# EAGLE design power_supply(iteration2) (EAGLE 9.6.2)
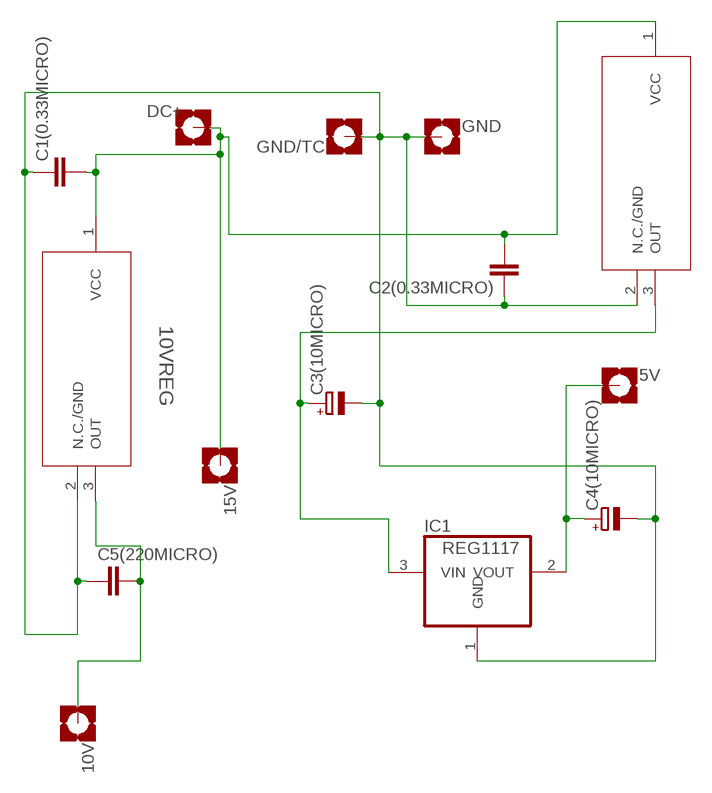
[diagram p0: schematic, sheet 1]

## Parts
5V  MOUNT-PAD-SQUARE2.8  [2,8-PAD-SQUARE]
10V  MOUNT-PAD-SQUARE2.8  [2,8-PAD-SQUARE]
10VREG  BAJ0BC0T  [TO220FP-3_ROM]
10VREG1  BAJ0BC0T  [TO220FP-3_ROM]
15V  MOUNT-PAD-SQUARE2.8  [2,8-PAD-SQUARE]
C1(0.33MICRO)  C-EU025-025X050  [C025-025X050]
C2(0.33MICRO)  C-EU025-025X050  [C025-025X050]
C3(10MICRO)  CPOL-EUE2.5-6  [E2,5-6]
C4(10MICRO)  CPOL-EUE2.5-6  [E2,5-6]
C5(220MICRO)  C-EUC1812K  [C1812K]
DC+  MOUNT-PAD-SQUARE2.8  [2,8-PAD-SQUARE]
GND  MOUNT-PAD-SQUARE2.8  [2,8-PAD-SQUARE]
GND/TC  MOUNT-PAD-SQUARE2.8  [2,8-PAD-SQUARE]
IC1  REG1117  [SOT223_HEATSINK]

## Nets
N$1: 10VREG1.1(VCC) 10VREG.1(VCC) 15V.B2,8(MOUNT) C1(0.33MICRO).2 C2(0.33MICRO).2 DC+.B2,8(MOUNT)
N$2: 10VREG1.2(N.C./GND) 10VREG.2(N.C./GND) C1(0.33MICRO).1 C2(0.33MICRO).1 C3(10MICRO).- C4(10MICRO).- C5(220MICRO).1 GND.B2,8(MOUNT) GND/TC.B2,8(MOUNT) IC1.1(GND)
N$3: 10V.B2,8(MOUNT) 10VREG.3(OUT) C5(220MICRO).2
N$5: 10VREG1.3(OUT) C3(10MICRO).+ IC1.3(VIN)
N$10: 5V.B2,8(MOUNT) C4(10MICRO).+ IC1.2(VOUT)

## Library data of the parts
5V 10V 15V DC+ GND GND/TC = holes:MOUNT-PAD-SQUARE: MOUNTING PAD, square
10VREG 10VREG1 = scipt_lib:BAJ0BC0T; BUILT_BY: EMA_Molly; COPYRIGHT: Copyright (C) 2018 Accelerated Designs. All rights reserved; MANUFACTURER_PART_NUMBER: BAJ0BC0T; SOURCELIBRARY: ROHM_2019-10-21; VENDOR: ROHM Semiconductor
C1(0.33MICRO) C2(0.33MICRO) C5(220MICRO) = rcl:C-EU: CAPACITOR, European symbol; SPICEPREFIX: C
C3(10MICRO) C4(10MICRO) = rcl:CPOL-EU: POLARIZED CAPACITOR, European symbol; SPICEPREFIX: C
IC1 = burr-brown-3:REG1117: 800mA and 1A Low Dropout (LDO) Positive Regulator 1.8V, 2.5V, 2.85V, 3.3V, 5V, and Adj

## Board
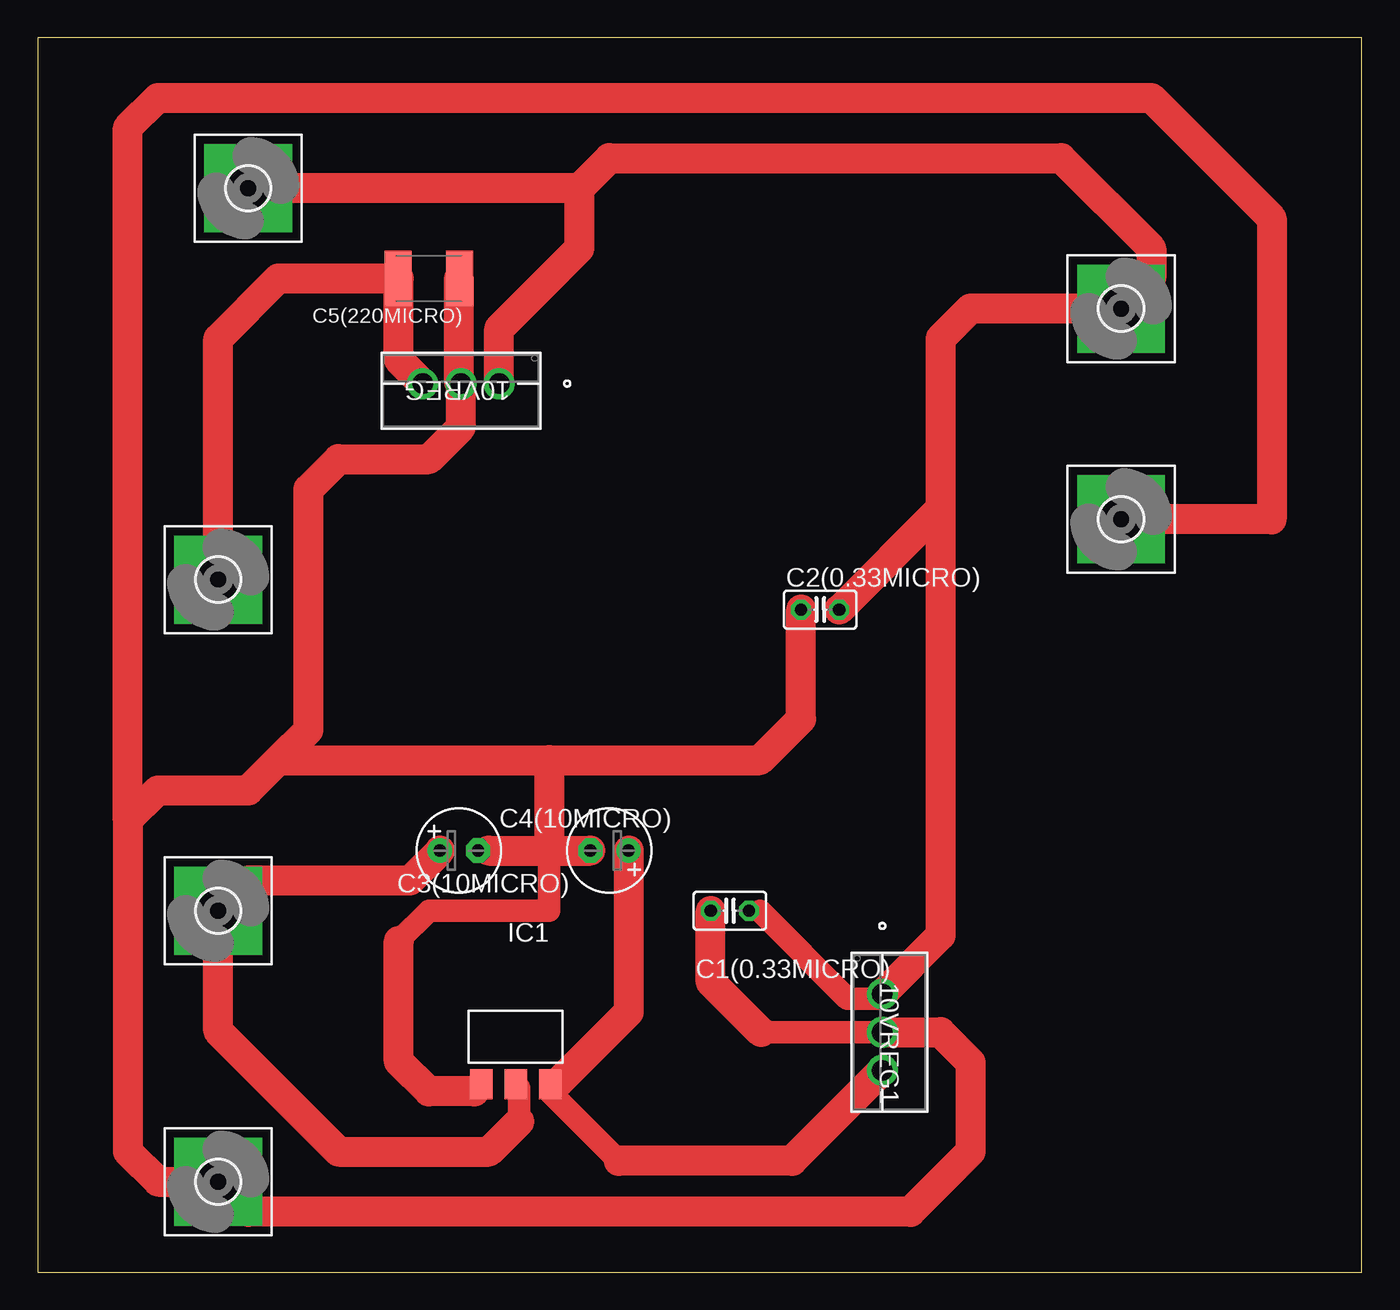
[diagram p1: board, top side]

Size 88 x 82 mm. Coordinates in mm from the lower left corner, seen from the top.
Outline: 0,0 88,0 88,82 0,82 0,0
Copper layers (1*16): Top 0.035mm / dielectric 1.5mm / Bottom 0.035mm
Design rules "default": minimum track width 6mil, minimum drill 0.35mm, track to track 6mil, track to pad 6mil, pad to pad 6mil, via to via 6mil, smd to smd 6mil, copper to edge 40mil, drill to drill 6mil, minimum pad ring 10mil, minimum via ring 8mil, stop-mask expansion 4mil, vias tented up to drill 0mil, thermal gap 10mil

### Footprints (pad centres in the part's own frame; a part is rotated, then mirrored left to right if it is on the bottom)
2,8-PAD-SQUARE = drill 2.8 pad 5.842 square: B2,8 0,0
TO220FP-3_ROM = drill 1.372 pad 1.88: 1 0,0; 2 2.54,0; 3 5.08,0
C025-025X050 = drill 0.813 octagon: 1 -1.27,0; 2 1.27,0
E2,5-6 = drill 0.813 pad 1.6: + -1.27,0 | drill 0.813 pad 1.6 octagon: - 1.27,0
C1812K = smd 1.8 x 3.7: 1 -2.05,0; 2 2.05,0
SOT223_HEATSINK = smd 1.499 x 2.007: 1 -2.261,-3.15; 2 0.025,-3.15; 3 2.311,-3.15

### Placement (x,y rotation side)
5V  12,24 0 top
10V  12,46 0 top
10VREG  30.67,59.02 180 top
10VREG1  56.13,18.47 270 top
15V  14,72 0 top
C1(0.33MICRO)  46,24 0 top
C2(0.33MICRO)  52,44 0 top
C3(10MICRO)  38,28 180 top
C4(10MICRO)  28,28 0 top
C5(220MICRO)  26,66 180 top
DC+  72,64 0 top
GND  12,6 0 top
GND/TC  72,50 0 top
IC1  31.75,15.62 0 top

### Tracks (layer width: path | path; a pad name or v marks a point on that pad's centre or on a via)
N$1
  Top 0.152: 10VREG1.1 55.83,18.17 55.66,18 | C1(0.33MICRO).2 48,24
  Top 1.5: 55.83,18.17 53.83,18.17 48,24
  Top 2: 36,72 15V.B2,8 | 10VREG.1 30.67,62.67 36,68 36,72 | 10VREG1.1 60,22.34 60,50.73 | 60,50.73 60,62 62,64 DC+.B2,8 74,66 74,68 68,74 38,74 36,72 | C2(0.33MICRO).2 60,50.73
N$2
  Top 0.152: 28.64,11.62 IC1.1 29.02,12 | 28,59.15 10VREG.2 28.13,58.13 | 28,65.95 C5(220MICRO).1 | 60,15.93 60.07,15.93 | C4(10MICRO).- 30,28
  Top 1.5: 24,22 26,24 34,24 34,28 | 10VREG1.2 48.07,15.93
  Top 2: 6,30 8,32 14,32 16,34 | 28,59.15 28,65.95 | GND/TC.B2,8 82,50 82,70 74,78 8,78 6,76 6,30 | 6,30 6,8 8,6 GND.B2,8 14,4 58,4 62,8 62,13.93 60,15.93 10VREG1.2 | 30,28 34,28 | 34,28 C3(10MICRO).- | 29.02,12 26,12 24,14 24,22 | 16,34 18,36 18,52 20,54 26,54 28.13,56.13 10VREG.2 | C2(0.33MICRO).1 50.73,36.73 48,34 34,34 | 16,34 34,34 | C1(0.33MICRO).1 44.73,19.27 48.07,15.93 | 34,34 34,28
N$3
  Top 0.152: 24,66 C5(220MICRO).2
  Top 2: 10V.B2,8 12,62 16,66 C5(220MICRO).2 | 10VREG.3 24,60.61 24,66
N$5
  Top 0.152: 34.47,12.47 IC1.3 34.06,11.94
  Top 1.5: 38.61,7.39 34.06,11.94
  Top 2: C3(10MICRO).+ 39.27,17.27 34.47,12.47 | 10VREG1.3 50.13,7.39 38.61,7.39
N$10
  Top 0.152: 32,12.25 IC1.2
  Top 1.5: 32,10 32,12.25
  Top 2: C4(10MICRO).+ 24.73,26 14,26 5V.B2,8 12,16 20,8 30,8 32,10